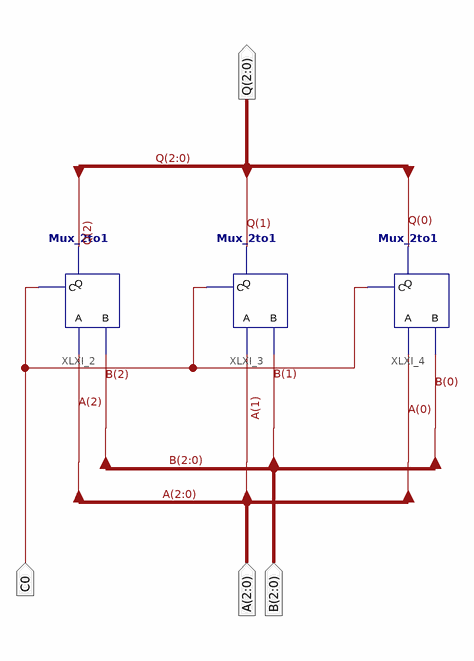
[diagram p0: schematic sheet 1]
// Xilinx ISE schematic Mux_2_3.sch (spartan3e) as structural Verilog: 3 symbols, 4 ports
module Mux_2_3 (
  input  C0,
  input  [2:0] A,
  input  [2:0] B,
  output [2:0] Q
);

  Mux_2to1 XLXI_2 (.A(A[2]), .B(B[2]), .C(C0), .Q(Q[2]));
  Mux_2to1 XLXI_3 (.A(A[1]), .B(B[1]), .C(C0), .Q(Q[1]));
  Mux_2to1 XLXI_4 (.A(A[0]), .B(B[0]), .C(C0), .Q(Q[0]));
endmodule
